# EAGLE schematic voltage_divider (EAGLE 9.6.1)
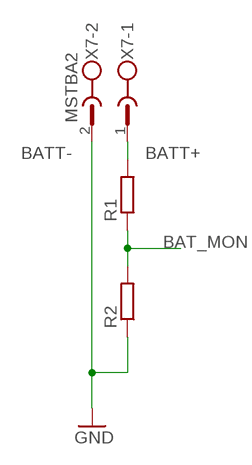
[diagram p0: schematic, sheet 1]

## Parts
R1  R-EU_0207/7  [0207/7]
R2  R-EU_0207/7  [0207/7]
X7  MSTBA2  [MSTBA2]

## Nets
BAT_MON: R1.1 R2.2
BATT+: R1.2 X7.1
BATT-: R2.1 X7.2 ; supply symbol labelled GND

## Library data of the parts
R1 R2 = resistor:R-EU_: RESISTOR, European symbol
X7 = con-phoenix-508:MSTBA2: PHOENIX; MF: FARNELL; MPN: 1757242; OC_FARNELL: 3705171; OC_NEWARK: 71C4161